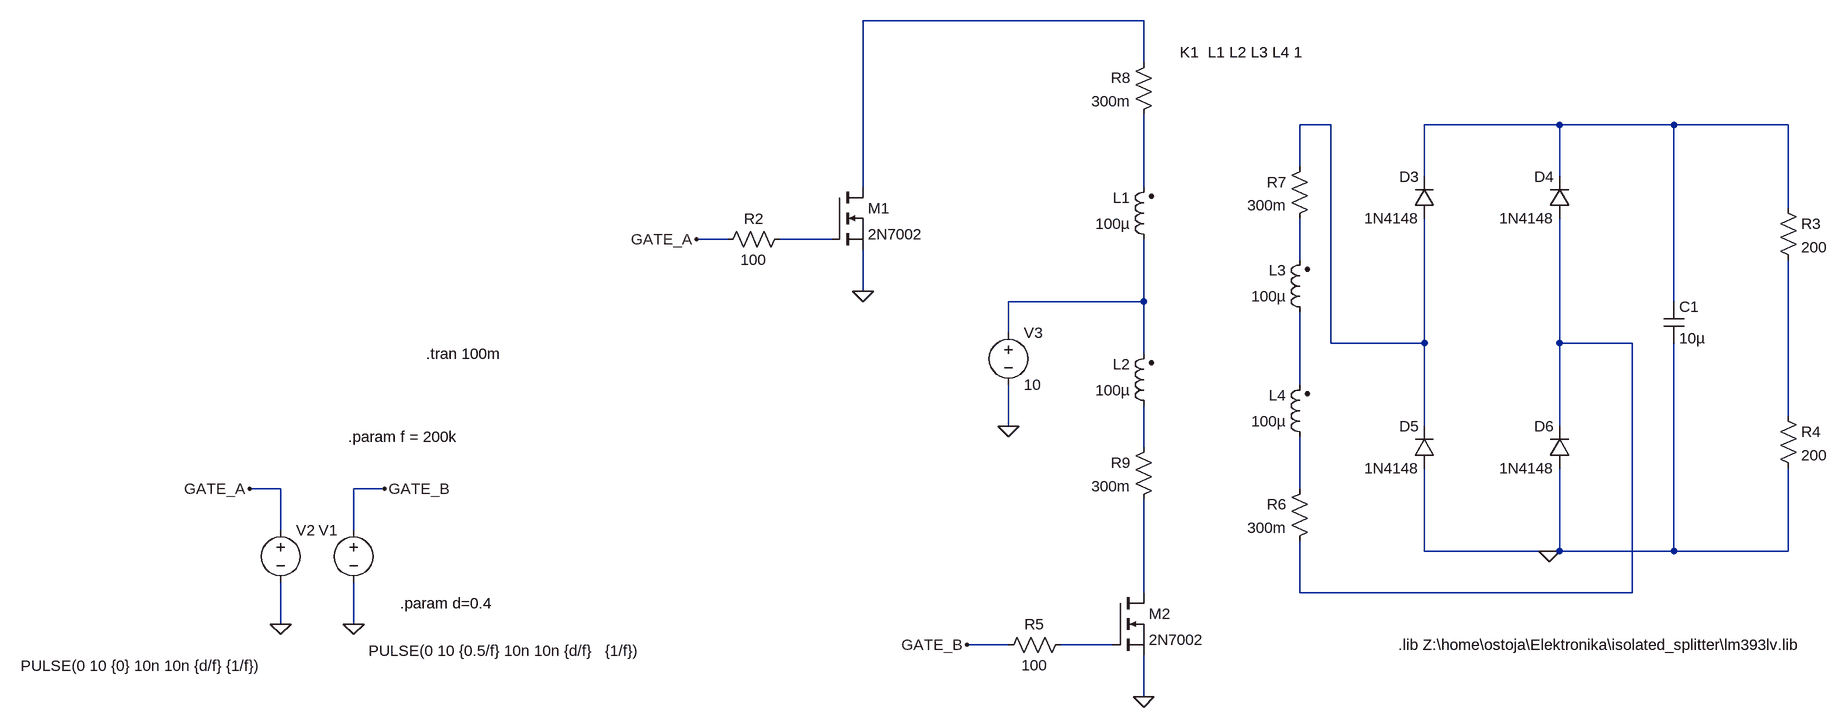
[diagram p0: schematic single_grec.asc]
single_grec.asc, the LTspice schematic file:
Version 4
SHEET 1 1792 680
WIRE 32 -1088 -400 -1088
WIRE 32 -1024 32 -1088
WIRE 320 -928 272 -928
WIRE 672 -928 464 -928
WIRE 848 -928 672 -928
WIRE 1024 -928 848 -928
WIRE 272 -864 272 -928
WIRE 464 -848 464 -928
WIRE 672 -848 672 -928
WIRE -400 -832 -400 -1088
WIRE 32 -832 32 -944
WIRE 1024 -800 1024 -928
WIRE -608 -752 -656 -752
WIRE -448 -752 -528 -752
WIRE 272 -720 272 -784
WIRE -400 -672 -400 -736
WIRE 32 -656 32 -752
WIRE 32 -656 -176 -656
WIRE 848 -656 848 -928
WIRE -176 -608 -176 -656
WIRE 320 -592 320 -928
WIRE 464 -592 464 -784
WIRE 464 -592 320 -592
WIRE 672 -592 672 -784
WIRE 784 -592 672 -592
WIRE 32 -576 32 -656
WIRE 272 -528 272 -640
WIRE 1024 -480 1024 -720
WIRE -176 -464 -176 -528
WIRE 464 -464 464 -592
WIRE 672 -464 672 -592
WIRE 32 -432 32 -496
WIRE -1296 -368 -1344 -368
WIRE -1136 -368 -1184 -368
WIRE 272 -368 272 -448
WIRE -1296 -304 -1296 -368
WIRE -1184 -304 -1184 -368
WIRE 464 -272 464 -400
WIRE 656 -272 464 -272
WIRE 672 -272 672 -400
WIRE 672 -272 656 -272
WIRE 848 -272 848 -592
WIRE 848 -272 672 -272
WIRE 1024 -272 1024 -400
WIRE 1024 -272 848 -272
WIRE 32 -208 32 -352
WIRE 272 -208 272 -288
WIRE 784 -208 784 -592
WIRE 784 -208 272 -208
WIRE -1296 -160 -1296 -224
WIRE -1184 -160 -1184 -224
WIRE -176 -128 -240 -128
WIRE -16 -128 -96 -128
WIRE 32 -48 32 -112
FLAG -1184 -160 0
FLAG -1136 -368 GATE_B
FLAG -1344 -368 GATE_A
FLAG -176 -464 0
FLAG -1296 -160 0
FLAG -656 -752 GATE_A
FLAG -240 -128 GATE_B
FLAG -400 -672 0
FLAG 32 -48 0
FLAG 656 -272 0
SYMBOL voltage -1184 -320 M0
WINDOW 123 0 0 Left 0
WINDOW 39 0 0 Left 0
WINDOW 3 -444 201 Left 2
SYMATTR Value PULSE(0 10 {0.5/f} 10n 10n {d/f}   {1/f})
SYMATTR InstName V1
SYMBOL voltage -1296 -320 R0
WINDOW 123 0 0 Left 0
WINDOW 39 0 0 Left 0
WINDOW 3 -400 224 Left 2
SYMATTR Value PULSE(0 10 {0} 10n 10n {d/f} {1/f})
SYMATTR InstName V2
SYMBOL voltage -176 -624 R0
WINDOW 123 0 0 Left 0
WINDOW 39 0 0 Left 0
SYMATTR InstName V3
SYMATTR Value 10
SYMBOL cap 832 -656 R0
SYMATTR InstName C1
SYMATTR Value 10µ
SYMBOL ind2 48 -736 R180
WINDOW 0 36 80 Left 2
WINDOW 3 36 40 Left 2
SYMATTR InstName L1
SYMATTR Value 100µ
SYMATTR Type ind
SYMATTR SpiceLine Rser=0.2
SYMBOL ind2 48 -480 R180
WINDOW 0 36 80 Left 2
WINDOW 3 36 40 Left 2
SYMATTR InstName L2
SYMATTR Value 100µ
SYMATTR Type ind
SYMATTR SpiceLine Rser=0.2
SYMBOL ind2 288 -624 R180
WINDOW 0 36 80 Left 2
WINDOW 3 36 40 Left 2
SYMATTR InstName L3
SYMATTR Value 100µ
SYMATTR Type ind
SYMATTR SpiceLine Rser=0.4
SYMBOL ind2 288 -432 R180
WINDOW 0 36 80 Left 2
WINDOW 3 36 40 Left 2
SYMATTR InstName L4
SYMATTR Value 100µ
SYMATTR Type ind
SYMATTR SpiceLine Rser=0.4
SYMBOL res 1008 -816 R0
SYMATTR InstName R3
SYMATTR Value 200
SYMBOL res 1008 -496 R0
SYMATTR InstName R4
SYMATTR Value 200
SYMBOL res 288 -384 M0
SYMATTR InstName R6
SYMATTR Value 300m
SYMBOL res 288 -880 M0
SYMATTR InstName R7
SYMATTR Value 300m
SYMBOL res 48 -1040 M0
SYMATTR InstName R8
SYMATTR Value 300m
SYMBOL res 48 -448 M0
SYMATTR InstName R9
SYMATTR Value 300m
SYMBOL res -512 -768 R90
WINDOW 0 0 56 VBottom 2
WINDOW 3 32 56 VTop 2
SYMATTR InstName R2
SYMATTR Value 100
SYMBOL nmos -448 -832 R0
SYMATTR InstName M1
SYMATTR Value 2N7002
SYMBOL res -80 -144 R90
WINDOW 0 0 56 VBottom 2
WINDOW 3 32 56 VTop 2
SYMATTR InstName R5
SYMATTR Value 100
SYMBOL nmos -16 -208 R0
SYMATTR InstName M2
SYMATTR Value 2N7002
SYMBOL diode 480 -784 R180
WINDOW 0 24 64 Left 2
WINDOW 3 24 0 Left 2
SYMATTR InstName D3
SYMATTR Value 1N4148
SYMBOL diode 688 -784 R180
WINDOW 0 24 64 Left 2
WINDOW 3 24 0 Left 2
SYMATTR InstName D4
SYMATTR Value 1N4148
SYMBOL diode 480 -400 R180
WINDOW 0 24 64 Left 2
WINDOW 3 24 0 Left 2
SYMATTR InstName D5
SYMATTR Value 1N4148
SYMBOL diode 688 -400 R180
WINDOW 0 24 64 Left 2
WINDOW 3 24 0 Left 2
SYMATTR InstName D6
SYMATTR Value 1N4148
TEXT -1072 -576 Left 2 !.tran 100m
TEXT 88 -1040 Left 2 !K1  L1 L2 L3 L4 1
TEXT -1192 -448 Left 2 !.param f = 200k
TEXT -1112 -192 Left 2 !.param d=0.4
TEXT 424 -128 Left 2 !.lib Z:\\home\\ostoja\\Elektronika\\isolated_splitter\\lm393lv.lib

The netlist it stands for:
* single_grec.asc
V1 GATE_B 0 PULSE(0 10 {0.5/f} 10n 10n {d/f}   {1/f})
V2 GATE_A 0 PULSE(0 10 {0} 10n 10n {d/f} {1/f})
V3 N007 0 10
C1 N003 0 10µ
L1 N007 N004 100µ Rser=0.2
L2 N011 N007 100µ Rser=0.2
L3 N009 N006 100µ Rser=0.4
L4 N012 N009 100µ Rser=0.4
R3 N003 N010 200
R4 N010 0 200
R6 N012 N008 300m
R7 N002 N006 300m
R8 N001 N004 300m
R9 N011 N013 300m
R2 N005 GATE_A 100
M1 N001 N005 0 0 2N7002
R5 N014 GATE_B 100
M2 N013 N014 0 0 2N7002
D3 N002 N003 1N4148
D4 N008 N003 1N4148
D5 0 N002 1N4148
D6 0 N008 1N4148
.model D D
.lib standard.dio
.model NMOS NMOS
.model PMOS PMOS
.lib standard.mos
.tran 100m
K1  L1 L2 L3 L4 1
.param f = 200k
.param d=0.4
.lib Z:\home\ostoja\Elektronika\isolated_splitter\lm393lv.lib
.backanno
.end